# EAGLE design sumoutputpanel (EAGLE 9.6.2)
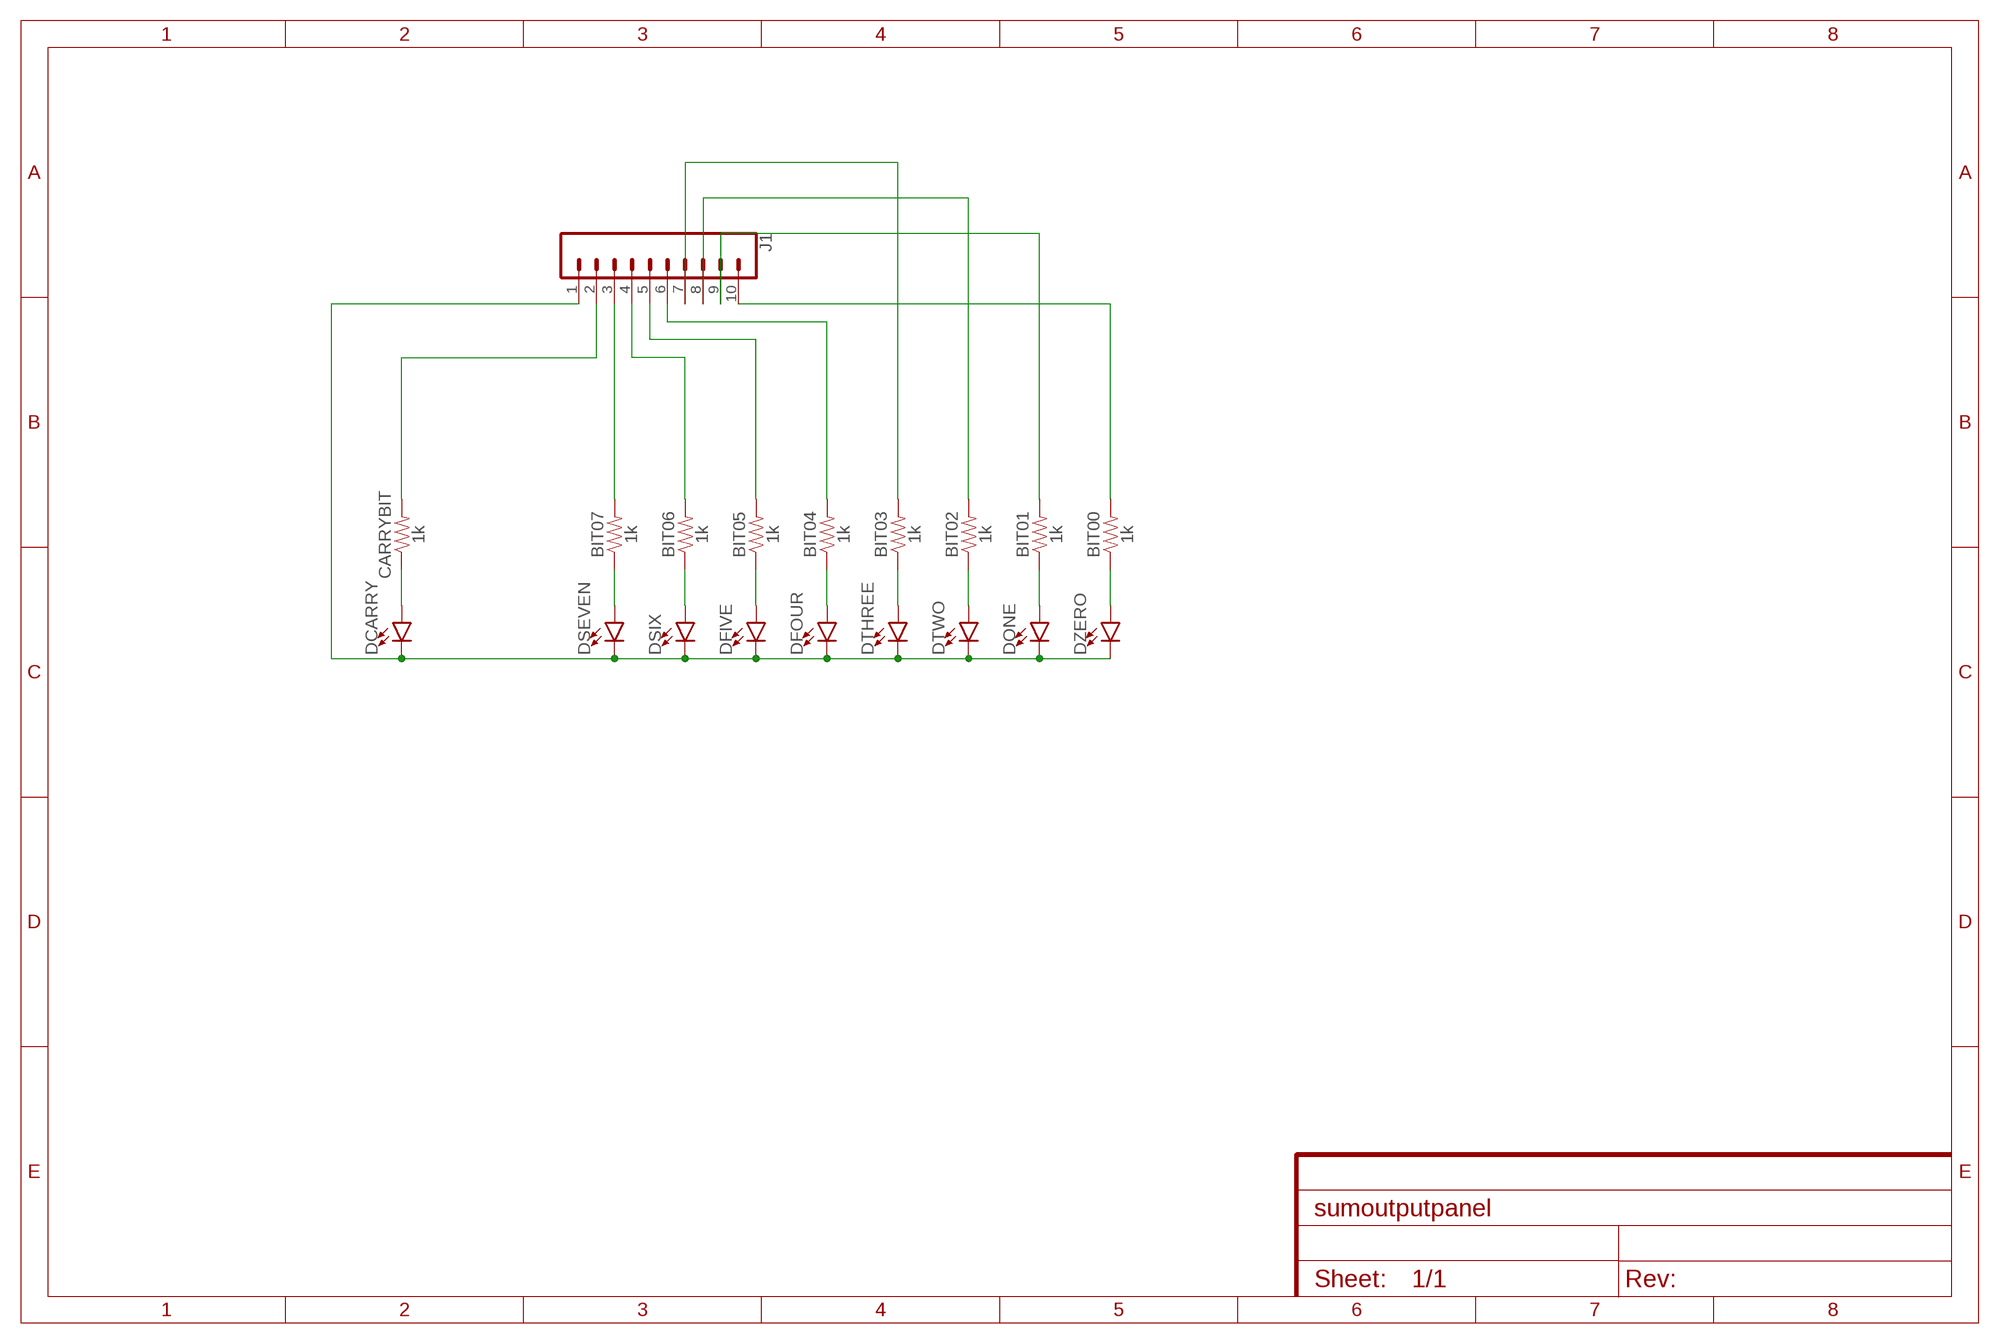
[diagram p0: schematic, sheet 1]

## Parts
BIT00  1k  1KOHM-HORIZ-1/4W-5%  [AXIAL-0.3]
BIT01  1k  1KOHM-HORIZ-1/4W-5%  [AXIAL-0.3]
BIT02  1k  1KOHM-HORIZ-1/4W-5%  [AXIAL-0.3]
BIT03  1k  1KOHM-HORIZ-1/4W-5%  [AXIAL-0.3]
BIT04  1k  1KOHM-HORIZ-1/4W-5%  [AXIAL-0.3]
BIT05  1k  1KOHM-HORIZ-1/4W-5%  [AXIAL-0.3]
BIT06  1k  1KOHM-HORIZ-1/4W-5%  [AXIAL-0.3]
BIT07  1k  1KOHM-HORIZ-1/4W-5%  [AXIAL-0.3]
CARRYBIT  1k  1KOHM-HORIZ-1/4W-5%  [AXIAL-0.3]
DCARRY  LED5MM  [LED_5MM]
DFIVE  LED5MM  [LED_5MM]
DFOUR  LED5MM  [LED_5MM]
DONE  LED5MM  [LED_5MM]
DSEVEN  LED5MM  [LED_5MM]
DSIX  LED5MM  [LED_5MM]
DTHREE  LED5MM  [LED_5MM]
DTWO  LED5MM  [LED_5MM]
DZERO  LED5MM  [LED_5MM]
J1  CONN_10"  [1X10]

## Nets
N$1: CARRYBIT.P$2 J1.2
N$2: BIT07.P$2 J1.3
N$3: BIT06.P$2 J1.4
N$4: BIT05.P$2 J1.5
N$5: BIT04.P$2 J1.6
N$6: BIT03.P$2 J1.7
N$7: BIT02.P$2 J1.8
N$8: BIT01.P$2 J1.9
N$9: BIT00.P$2 J1.10
N$10: CARRYBIT.P$1 DCARRY.A
N$11: BIT07.P$1 DSEVEN.A
N$12: BIT06.P$1 DSIX.A
N$13: BIT05.P$1 DFIVE.A
N$14: BIT04.P$1 DFOUR.A
N$15: BIT03.P$1 DTHREE.A
N$16: BIT02.P$1 DTWO.A
N$17: BIT01.P$1 DONE.A
N$18: BIT00.P$1 DZERO.A
N$19: DCARRY.K(C) DFIVE.K(C) DFOUR.K(C) DONE.K(C) DSEVEN.K(C) DSIX.K(C) DTHREE.K(C) DTWO.K(C) DZERO.K(C) J1.1

## Library data of the parts
BIT00 BIT01-BIT07 CARRYBIT = SparkFun-Resistors:1KOHM: 1kΩ resistor A resistor is a passive two-terminal electrical component that implements electrical resistance as a circuit element. Resistors act to reduce current flow, and, at the same time, act to lower voltage levels within circuits. - Wikipedia; PROD_ID: RES-08380
DCARRY DFIVE DFOUR DONE DSEVEN DSIX DTHREE DTWO DZERO = SparkFun-LED:LED: LED (Generic) Standard schematic elements and footprints for 5mm, 3mm, 1206, and 0603 sized LEDs. Generic LEDs with no color specified.
J1 = SparkFun-Connectors:CONN_10: Multi connection point. Often used as Generic Header-pin footprint for 0.1 inch spaced/style header connections On any of the 0.1 inch spaced packages, you can populate with these: Break Away Headers - Straight <https://www.sparkfun.com/products/116> (PRT-00116) Break Away Male Headers - Right Angle <https://www.sparkfun.com/products/553> (PRT-00553) Female Headers <https://www.sparkfun.com/products/115> (PRT-00115) Break Away Headers - Machine Pin <https://www.sparkfun.com/products/117> (PRT-00117) Break Away Female Headers - Swiss Machine Pin <https://www.sparkfun.com/products/743> (PRT-00743) Arduino Stackable Header - 10 Pin <https://www.sparkfun.com/products/11376> (PRT-11376) For SCREWTERMINALS and SPRING TERMINALS visit here: Screw Terimnals on SparkFun.com <https://www.sparkfun.com/search/results?term=Screw+Terminals> (5mm/3.5mm/2.54mm spacing) This device is also useful as a general connection point to wire up your design to another part of your project. Our various solder wires solder well into these plated through hole pads. Hook-Up Wire - Assortment (Stranded, 22 AWG) <https://www.sparkfun.com/products/11375> (PRT-11375) Hook-Up Wire - Assortment (Solid Core, 22 AWG) <https://www.sparkfun.com/products/11367> (PRT-11367) View the entire wire category on our website here <https://www.sparkfun.com/categories/141> Special notes: Molex polarized connector foot print use with SKU : PRT-08231 with associated crimp pins and housings. 1MM SMD Version SKU: PRT-10208 NOTES ON THE VARIANTS LOCK and LOCK_LONGPADS... This footprint was designed to help hold the alignment of a through-hole component (i.e. 6-pin header) while soldering it into place. You may notice that each hole has been shifted either up or down by 0.005 of an inch from it's more standard position (which is a perfectly straight line). This slight alteration caused the pins (the squares in the middle) to touch the edges of the holes. Because they are alternating, it causes a "brace" to hold the component in place. 0.005 has proven to be the perfect amount of "off-center" position when using our standard breakaway headers. Although looks a little odd when you look at the bare footprint, once you have a header in there, the alteration is very hard to notice. Also,if you push a header all the way into place, it is covered up entirely on the bottom side.; PROD_ID: CONN-11563

## Board
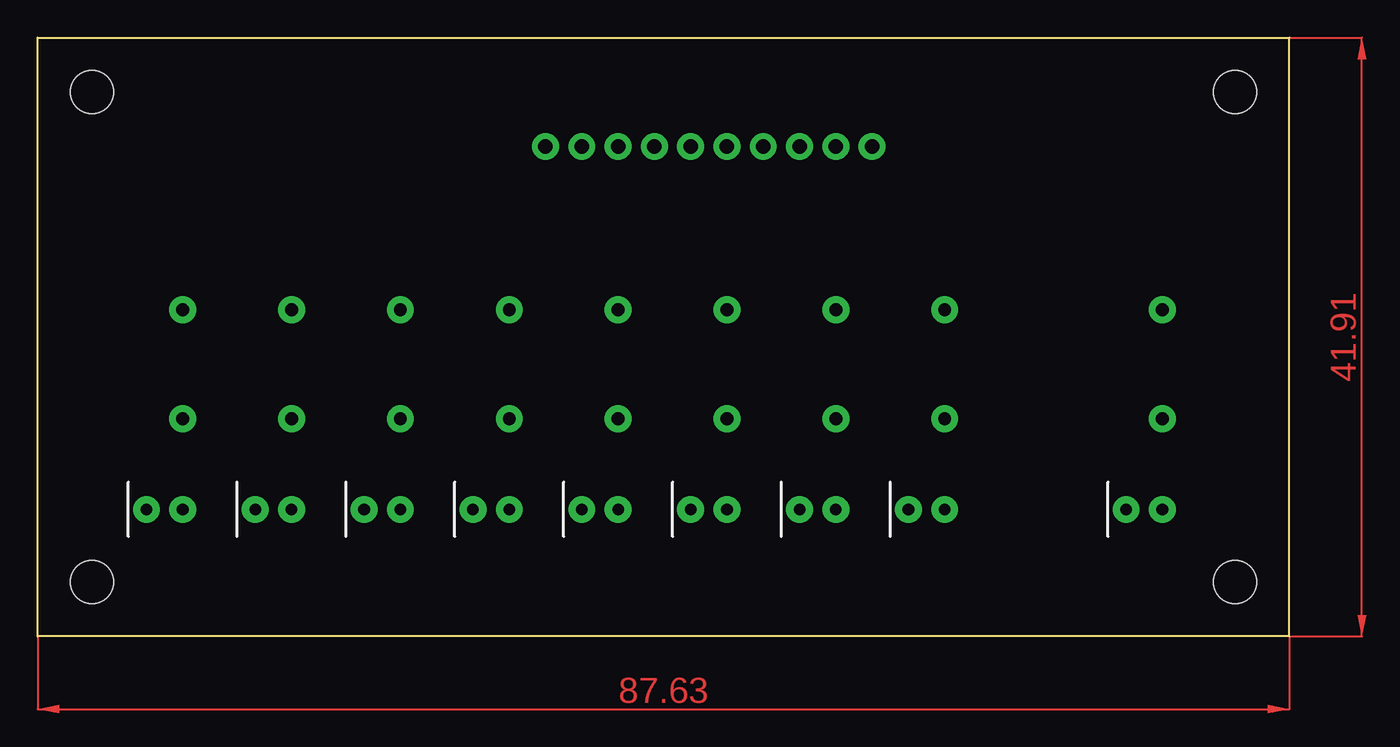
[diagram p1: board, top side]
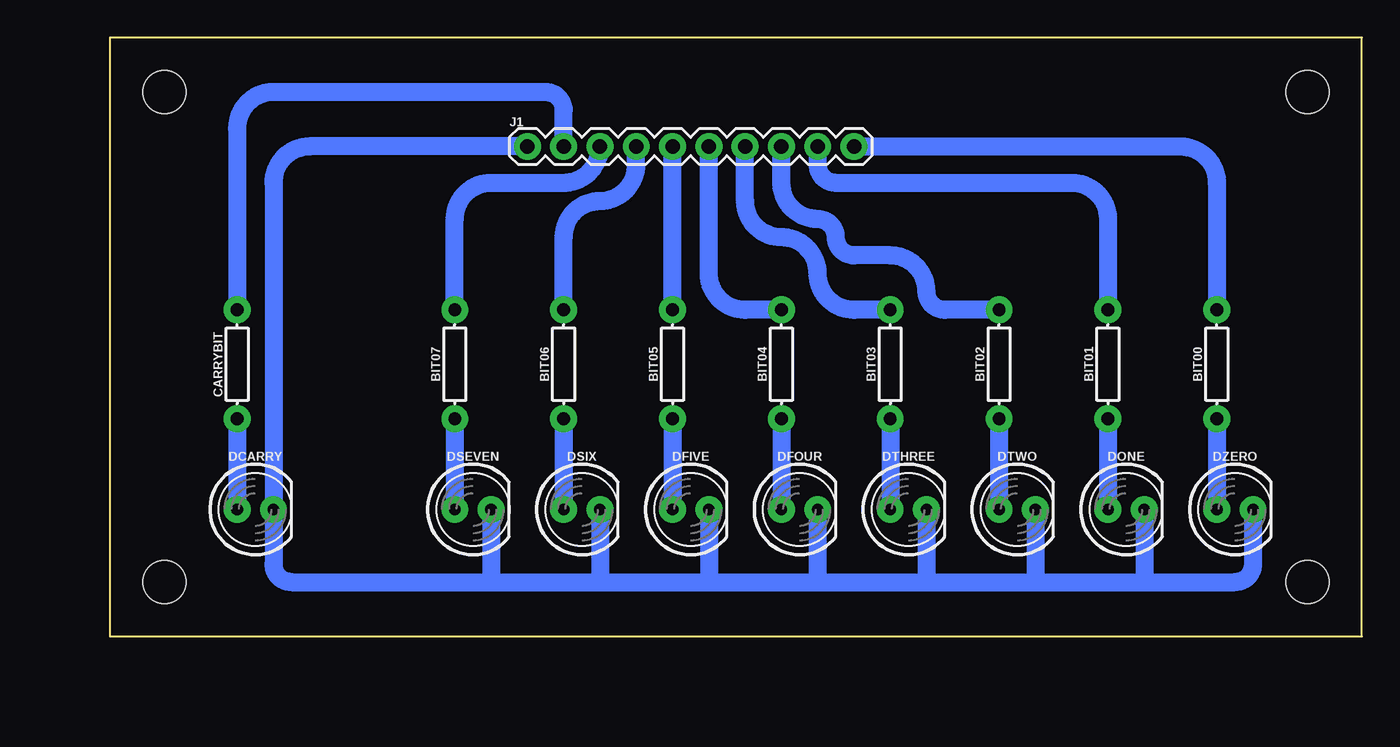
[diagram p2: board, bottom side, seen from below]

Size 87.63 x 41.91 mm. Coordinates in mm from the lower left corner, seen from the top.
Outline: 87.63,0 0,0 0,41.91 87.63,41.91 87.63,0
Copper layers (1*16): Top 0.035mm / dielectric 1.5mm / Bottom 0.035mm
Design rules "default": minimum track width 6mil, minimum drill 0.35mm, track to track 6mil, track to pad 6mil, pad to pad 6mil, via to via 6mil, smd to smd 6mil, copper to edge 40mil, drill to drill 6mil, minimum pad ring 10mil, minimum via ring 8mil, stop-mask expansion 4mil, vias tented up to drill 0mil, thermal gap 10mil
Holes 3 mm at 83.82,38.1 83.82,3.81 3.81,38.1 3.81,3.81

### Footprints (pad centres in the part's own frame; a part is rotated, then mirrored left to right if it is on the bottom)
AXIAL-0.3 = drill 0.9 pad 1.88: P$1 -3.81,0; P$2 3.81,0
LED_5MM = drill 0.813 pad 1.88: A -1.27,0; K 1.27,0
1X10 = drill 1.016 pad 1.88: 1 0,0; 2 2.54,0; 3 5.08,0; 4 7.62,0; 5 10.16,0; 6 12.7,0; 7 15.24,0; 8 17.78,0; 9 20.32,0; 10 22.86,0

### Placement (x,y rotation side)
BIT00  10.16,19.05 90 bottom
BIT01  17.78,19.05 90 bottom
BIT02  25.4,19.05 90 bottom
BIT03  33.02,19.05 90 bottom
BIT04  40.64,19.05 90 bottom
BIT05  48.26,19.05 90 bottom
BIT06  55.88,19.05 90 bottom
BIT07  63.5,19.05 90 bottom
CARRYBIT  78.74,19.05 90 bottom
DCARRY  77.47,8.89 0 bottom
DFIVE  46.99,8.89 0 bottom
DFOUR  39.37,8.89 0 bottom
DONE  16.51,8.89 0 bottom
DSEVEN  62.23,8.89 0 bottom
DSIX  54.61,8.89 0 bottom
DTHREE  31.75,8.89 0 bottom
DTWO  24.13,8.89 0 bottom
DZERO  8.89,8.89 0 bottom
J1  58.42,34.29 0 bottom

### Tracks (layer width: path | path; a pad name or v marks a point on that pad's centre or on a via)
N$1
  Bottom 1.27: J1.2 55.88,36.83 arc-90 57.15,38.1 76.2,38.1 arc-90 78.74,35.56 CARRYBIT.P$2
N$2
  Bottom 1.27: BIT07.P$2 63.5,29.21 arc90 60.96,31.75 55.88,31.75 arc-90 J1.3
N$3
  Bottom 1.27: BIT06.P$2 55.88,27.94 arc90 53.34,30.48 arc-90 50.8,33.02 J1.4
N$4
  Bottom 1.27: BIT05.P$2 J1.5
N$5
  Bottom 1.27: BIT04.P$2 43.18,22.86 arc90 45.72,25.4 J1.6
N$6
  Bottom 1.27: BIT03.P$2 35.56,22.86 arc90 38.1,25.4 arc-90 40.64,27.94 arc90 43.18,30.48 J1.7
N$7
  Bottom 1.27: BIT02.P$2 29.21,22.86 arc90 30.48,24.13 arc-90 33.02,26.67 35.56,26.67 arc90 36.83,27.94 arc-90 38.1,29.21 arc90 40.64,31.75 J1.8
N$8
  Bottom 1.27: J1.9 38.1,33.02 arc-90 36.83,31.75 20.32,31.75 arc90 17.78,29.21 BIT01.P$2
N$9
  Bottom 1.27: J1.10 12.7,34.29 arc90 10.16,31.75 BIT00.P$2
N$10
  Bottom 1.27: CARRYBIT.P$1 DCARRY.A
N$11
  Bottom 1.27: BIT07.P$1 DSEVEN.A
N$12
  Bottom 1.27: BIT06.P$1 DSIX.A
N$13
  Bottom 1.27: BIT05.P$1 DFIVE.A
N$14
  Bottom 1.27: BIT04.P$1 DFOUR.A
N$15
  Bottom 1.27: BIT03.P$1 DTHREE.A
N$16
  Bottom 1.27: BIT02.P$1 DTWO.A
N$17
  Bottom 1.27: BIT01.P$1 DONE.A
N$18
  Bottom 1.27: BIT00.P$1 DZERO.A
N$19
  Bottom 1.27: 60.96,3.81 74.93,3.81 arc90 76.2,5.08 DCARRY.K 76.2,31.75 arc90 73.66,34.29 J1.1 | 60.96,3.81 53.34,3.81 | 53.34,3.81 45.72,3.81 | 45.72,3.81 38.1,3.81 | 38.1,3.81 30.48,3.81 | 30.48,3.81 22.86,3.81 | 22.86,3.81 15.24,3.81 | 15.24,3.81 8.89,3.81 arc-90 7.62,5.08 DZERO.K | DSEVEN.K 60.96,3.81 | DSIX.K 53.34,3.81 | DFIVE.K 45.72,3.81 | DFOUR.K 38.1,3.81 | DTHREE.K 30.48,3.81 | DTWO.K 22.86,3.81 | DONE.K 15.24,3.81
(copper drawn outside any net)
  shapes: Top area x2